# Altium schematic sheet calibration-hw.SchDoc
size A2; SheetNumber: 2; SheetTotal: 10
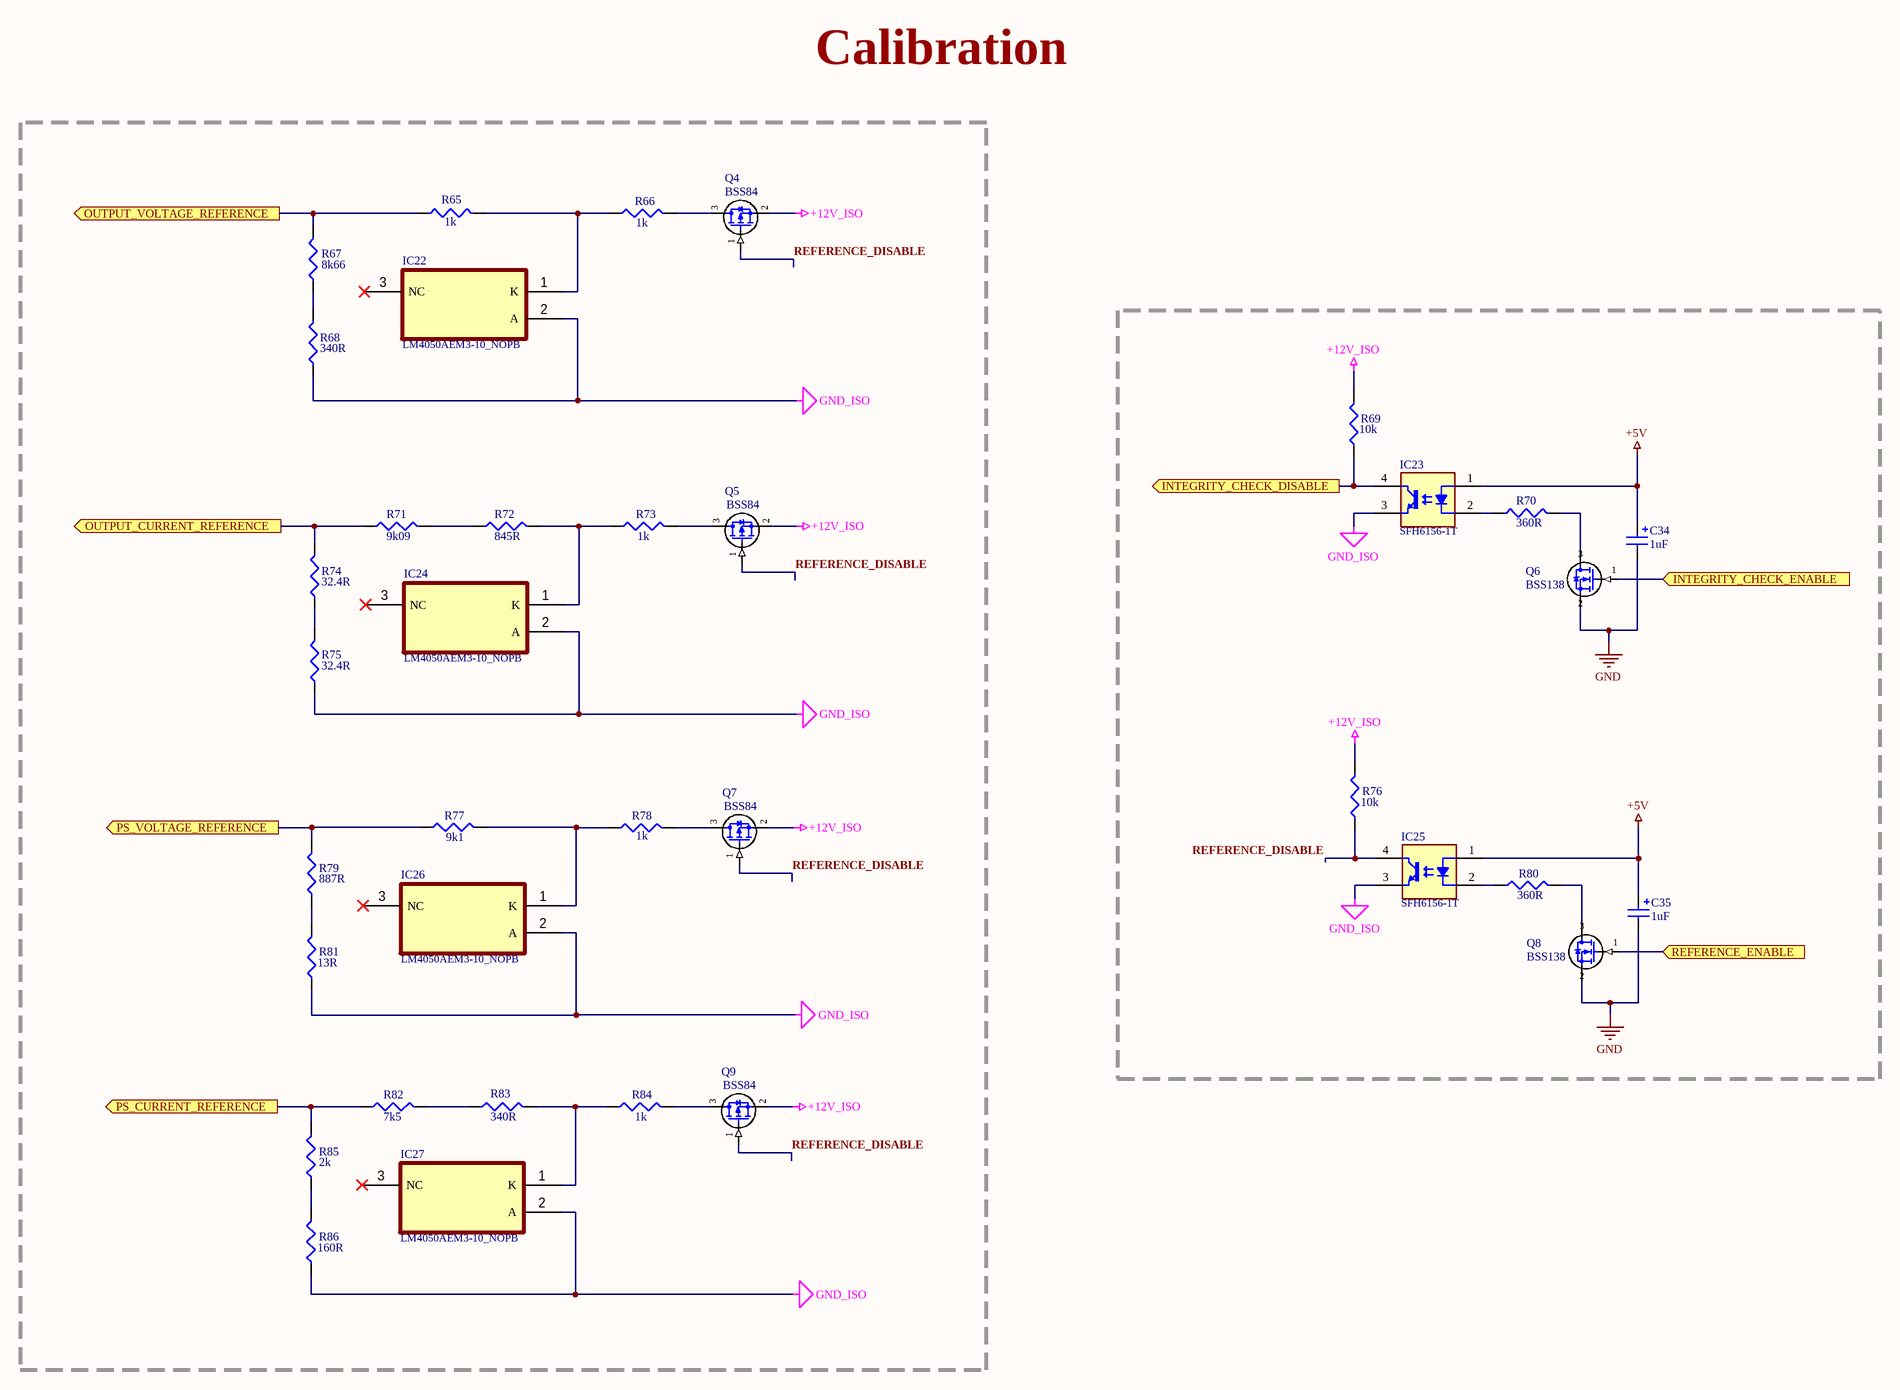
[diagram p0: calibration-hw.SchDoc]

## Parts
C34  1uF  [C1206]
C35  1uF  [C1206]
IC22  LM4050AEM3-10_NOPB  [SOT_23_3]
IC23  SFH6156-1T  [SMD-4]
IC24  LM4050AEM3-10_NOPB  [SOT_23_3]
IC25  SFH6156-1T  [SMD-4]
IC26  LM4050AEM3-10_NOPB  [SOT_23_3]
IC27  LM4050AEM3-10_NOPB  [SOT_23_3]
Q4  BSS84  [SOT_23_3]
Q5  BSS84  [SOT_23_3]
Q6  BSS138  [SOT_23_3]
Q7  BSS84  [SOT_23_3]
Q8  BSS138  [SOT_23_3]
Q9  BSS84  [SOT_23_3]
R65  1k  [Resistor 0805]
R66  1k  [Resistor 0805]
R67  8k66  [Resistor 0805]
R68  340R  [Resistor 0805]
R69  10k  [Resistor 0805]
R70  360R  [Resistor 0805]
R71  9k09  [Resistor 0805]
R72  845R  [Resistor 0805]
R73  1k  [Resistor 0805]
R74  32.4R  [Resistor 0805]
R75  32.4R  [Resistor 0805]
R76  10k  [Resistor 0805]
R77  9k1  [Resistor 0805]
R78  1k  [Resistor 0805]
R79  887R  [Resistor 0805]
R80  360R  [Resistor 0805]
R81  13R  [Resistor 0805]
R82  7k5  [Resistor 0805]
R83  340R  [Resistor 0805]
R84  1k  [Resistor 0805]
R85  2k  [Resistor 0805]
R86  160R  [Resistor 0805]

## Ports
INTEGRITY_CHECK_DISABLE (out, see measurement-output-hw[2B], measurement-output-hw[2D], measurement-output-hw[4B], measurement-output-hw[4D], measurement-ps1-hw[1C], measurement-ps1-hw[3C], measurement-ps2-hw[1B], measurement-ps2-hw[3B], measurement-ps3-hw[1B], measurement-ps3-hw[3B]), INTEGRITY_CHECK_ENABLE (in, see beaglebone-interface-hw[3B]), OUTPUT_CURRENT_REFERENCE (out, see measurement-output-hw[2D]), OUTPUT_VOLTAGE_REFERENCE (out, see measurement-output-hw[2B]), PS_CURRENT_REFERENCE (out, see measurement-ps1-hw[3C], measurement-ps2-hw[3C], measurement-ps3-hw[3C]), PS_VOLTAGE_REFERENCE (out, see measurement-ps1-hw[1C], measurement-ps2-hw[1C], measurement-ps3-hw[1C]), REFERENCE_ENABLE (in, see beaglebone-interface-hw[4B])

## Nets
+5V: C34.1 C35.1 IC23.1(A) IC25.1(A)
+12V_ISO: Q4.2(S) Q5.2(S) Q7.2(S) Q9.2(S) R69.2 R76.2
GND: C34.2 C35.2 Q6.2(S) Q8.2(S)
GND_ISO: IC22.2(A) IC23.3(E) IC24.2(A) IC25.3(E) IC26.2(A) IC27.2(A) R68.1 R75.1 R81.1 R86.1
INTEGRITY_CHECK_DISABLE: IC23.4(C) R69.1 ; port INTEGRITY_CHECK_DISABLE
INTEGRITY_CHECK_ENABLE: Q6.1(G) ; port INTEGRITY_CHECK_ENABLE
OUTPUT_CURRENT_REFERENCE: R71.1 R74.2 ; port OUTPUT_CURRENT_REFERENCE
OUTPUT_VOLTAGE_REFERENCE: R65.1 R67.2 ; port OUTPUT_VOLTAGE_REFERENCE
PS_CURRENT_REFERENCE: R82.1 R85.2 ; port PS_CURRENT_REFERENCE
PS_VOLTAGE_REFERENCE: R77.1 R79.2 ; port PS_VOLTAGE_REFERENCE
REFERENCE_DISABLE: IC25.4(C) Q4.1(G) Q5.1(G) Q7.1(G) Q9.1(G) R76.1
REFERENCE_ENABLE: Q8.1(G) ; port REFERENCE_ENABLE
NetIC22_1: IC22.1(K) R65.2 R66.1
NetIC23_2: IC23.2(C) R70.1
NetIC24_1: IC24.1(K) R72.2 R73.1
NetIC25_2: IC25.2(C) R80.1
NetIC26_1: IC26.1(K) R77.2 R78.1
NetIC27_1: IC27.1(K) R83.2 R84.1
NetQ4_3: Q4.3(D) R66.2
NetQ5_3: Q5.3(D) R73.2
NetQ6_3: Q6.3(D) R70.2
NetQ7_3: Q7.3(D) R78.2
NetQ8_3: Q8.3(D) R80.2
NetQ9_3: Q9.3(D) R84.2
NetR67_1: R67.1 R68.2
NetR71_2: R71.2 R72.1
NetR74_1: R74.1 R75.2
NetR79_1: R79.1 R81.2
NetR82_2: R82.2 R83.1
NetR85_1: R85.1 R86.2

Not connected (* = marked no-connect by the designer): IC22 3(NC)*; IC24 3(NC)*; IC26 3(NC)*; IC27 3(NC)*

## Notes on the sheet
- Calibration
- Title:
- Drawn by:
- Revision:
- Copyright CNPEM 2023.
  This documentation describes Open Hardware and is licensed under the CERN OHL S v2. You may redistribute and modify this documentation under the terms of the CERN OHL S v2. (https://www.ohwr.org/cernohl). This documentation is distributed WITHOUT ANY EXPRESS OR IMPLIED WARRANTY, INCLUDING OF MERCHANTABILITY, SATISFACTORY QUALITY AND FITNESS FOR A PARTICULAR PURPOSE. Please see the CERN OHL S v2 for applicable conditions.
- File:
- Date:
- Project:
- Time:
- Sheet
- of
- ENT - AIS - SEI
  Sistemas Eletrônicos e
  Instrumentação

## Library data of the parts
C34 C35 = Capacitor 1uF
IC22 IC24 IC26 IC27 = LM4050AEM3-10_NOPB: Precision Micropower Shunt Voltage Reference
IC23 IC25 = SFH6156-1T: Optocoupler 1 Channel, Phototransistor Output, SMD-4
Q4 Q5 Q7 Q9 = BSS84: MOSFET P-Channel
Q6 Q8 = BSS138: MOSFET N-Channel; Supplier 1: Digi-Key; Supplier Part Number 1: BSS138DKR-ND
R65 R66 R73 R78 R84 = Resistor 1k
R67 = Resistor 8k66
R68 R83 = Resistor 340R
R69 R76 = Resistor 10k
R70 R80 = Resistor 360R
R71 = Resistor 9k09
R72 = Resistor 845R
R74 R75 = Resistor 32.4R
R77 = Resistor 9k1
R79 = Resistor 887R
R81 = Resistor 13R
R82 = Resistor 7k5
R85 = Resistor 2k
R86 = Resistor 160R